# EasyEDA Pro project llc.eprj

# Schematic Schematic1

## Sheets
1 P1: Create Date: 2024-04-23; Page Name: P1; Project Name: llc; Schematic Name: Schematic1; Update Date: 2024-04-23; Company: EasyEDA.com; Drawn: EasyEDA; Page Size: A4; Part Number: JLCPCB-002; Reviewed: EasyEDA; Version: V0.1
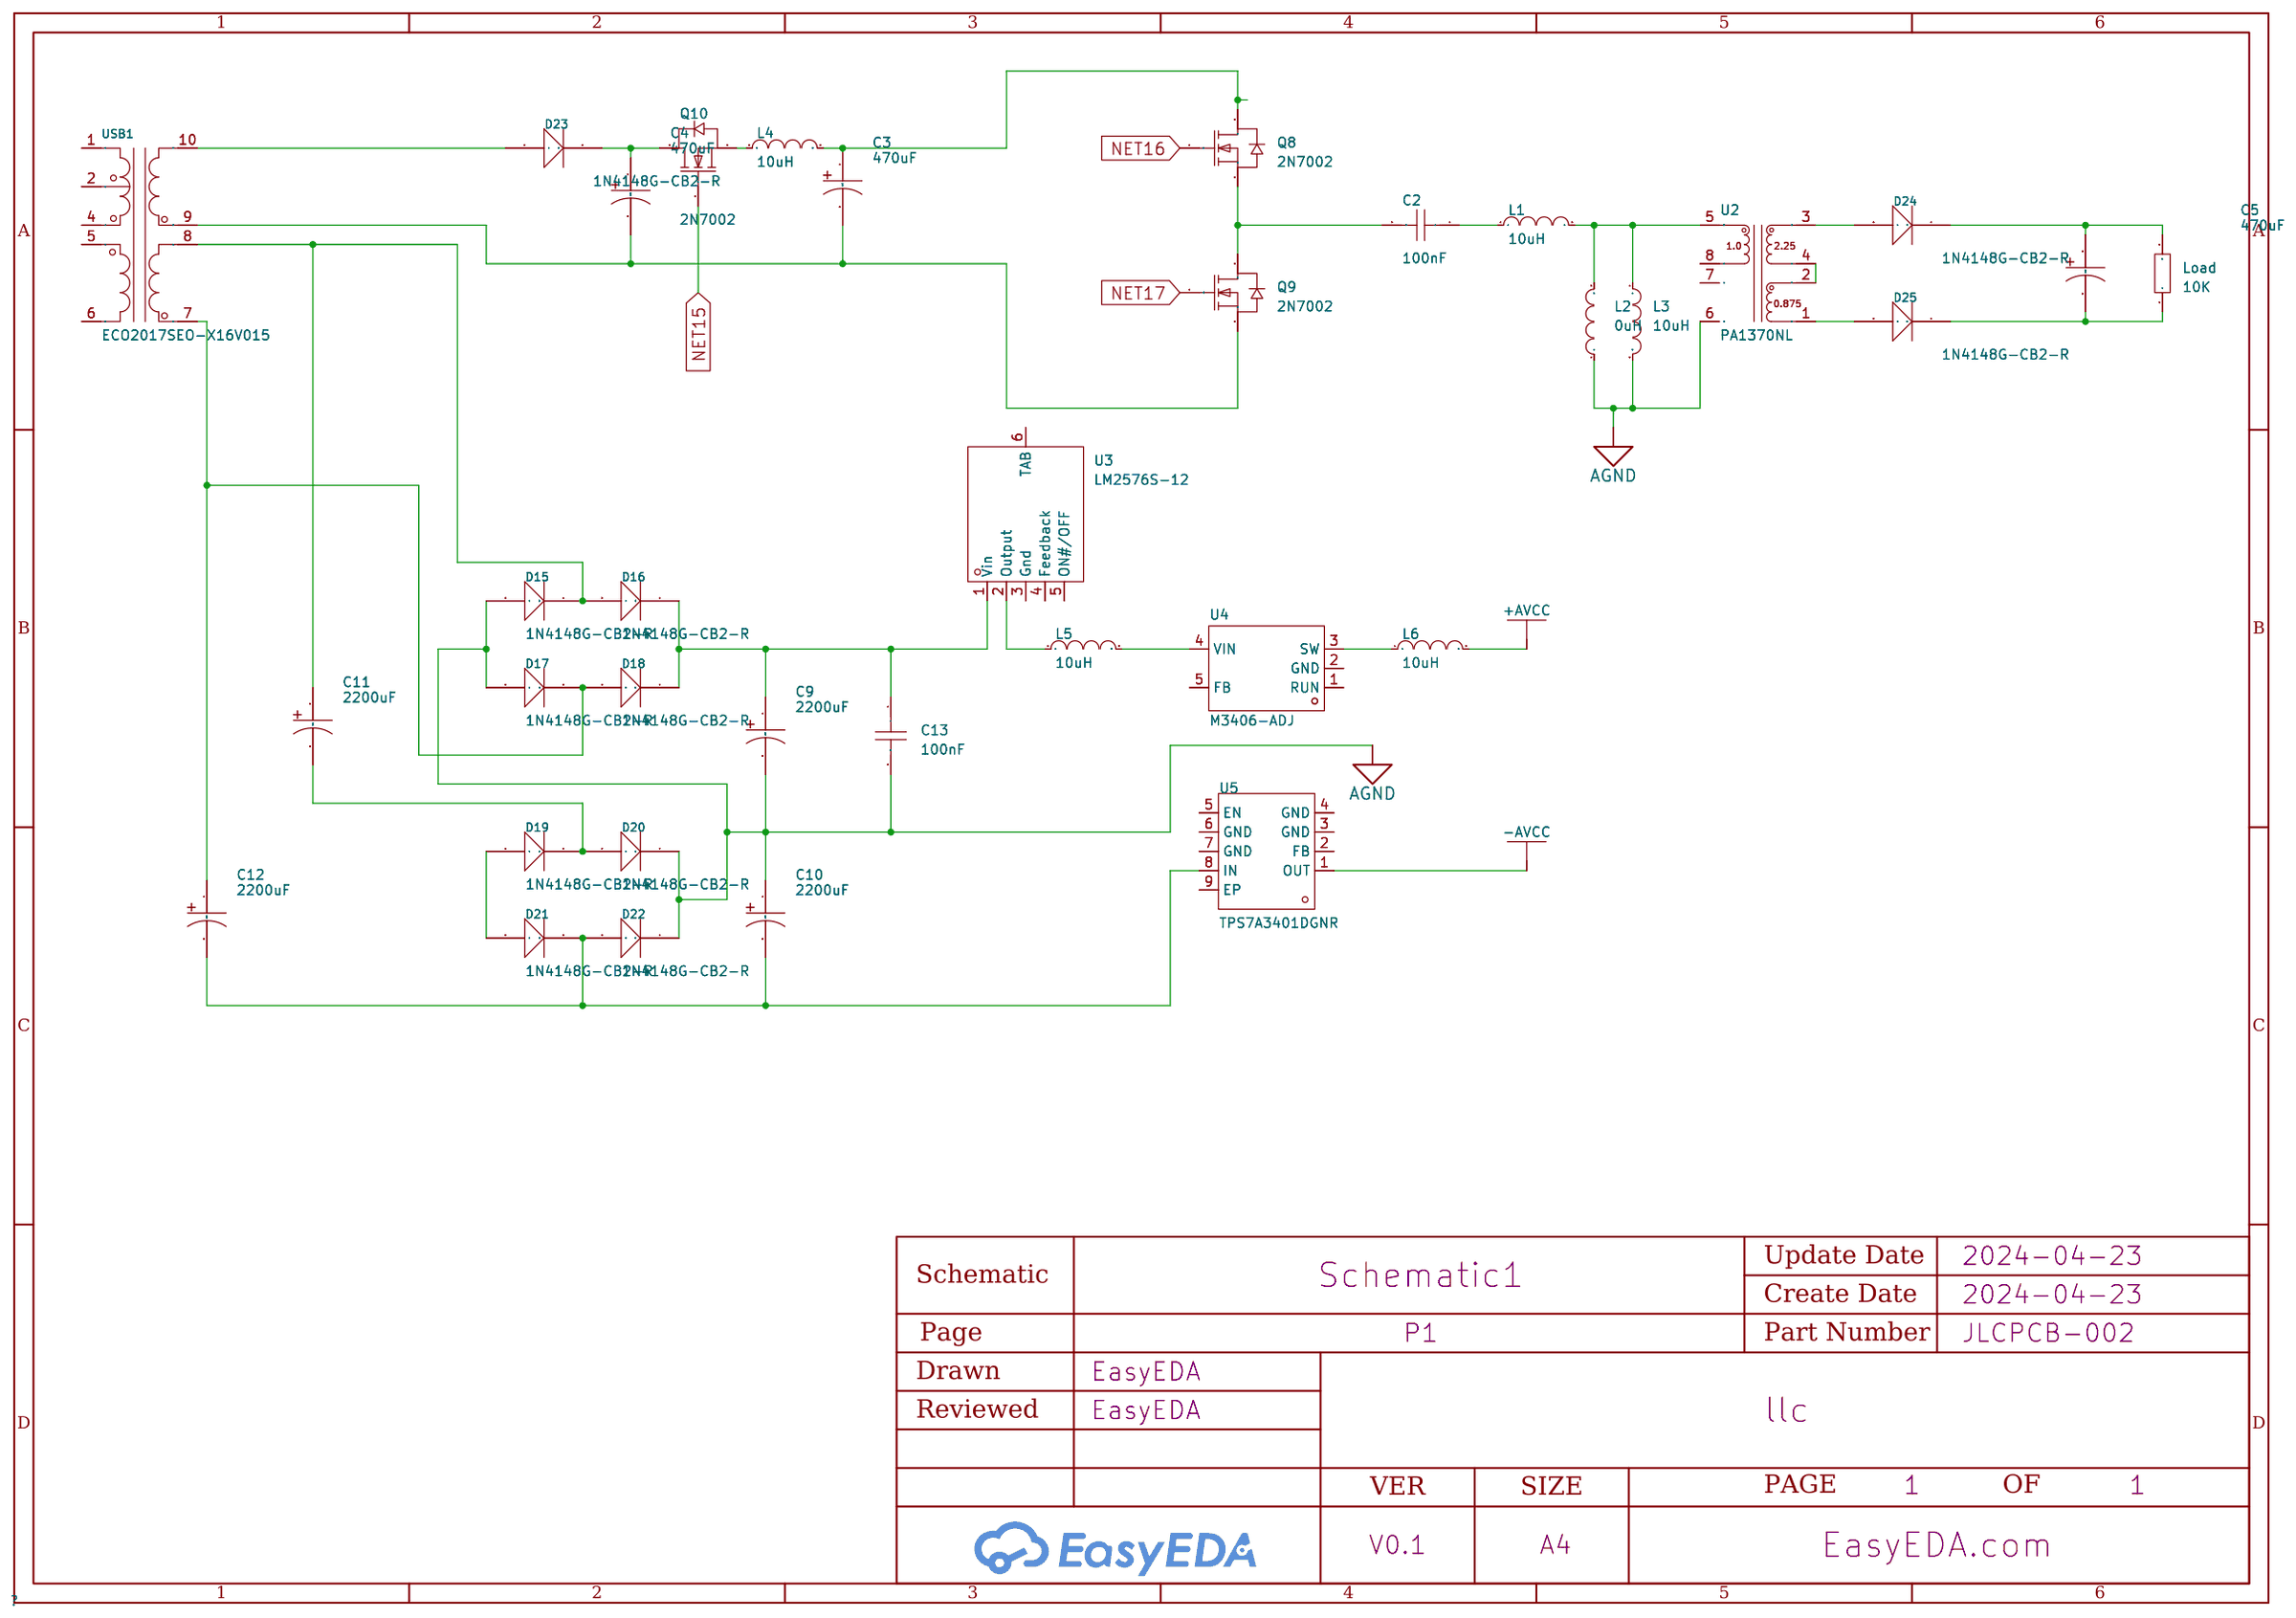
[diagram p0: P1]
2 P3: Page Name: P3; Update Date: 2024-04-24
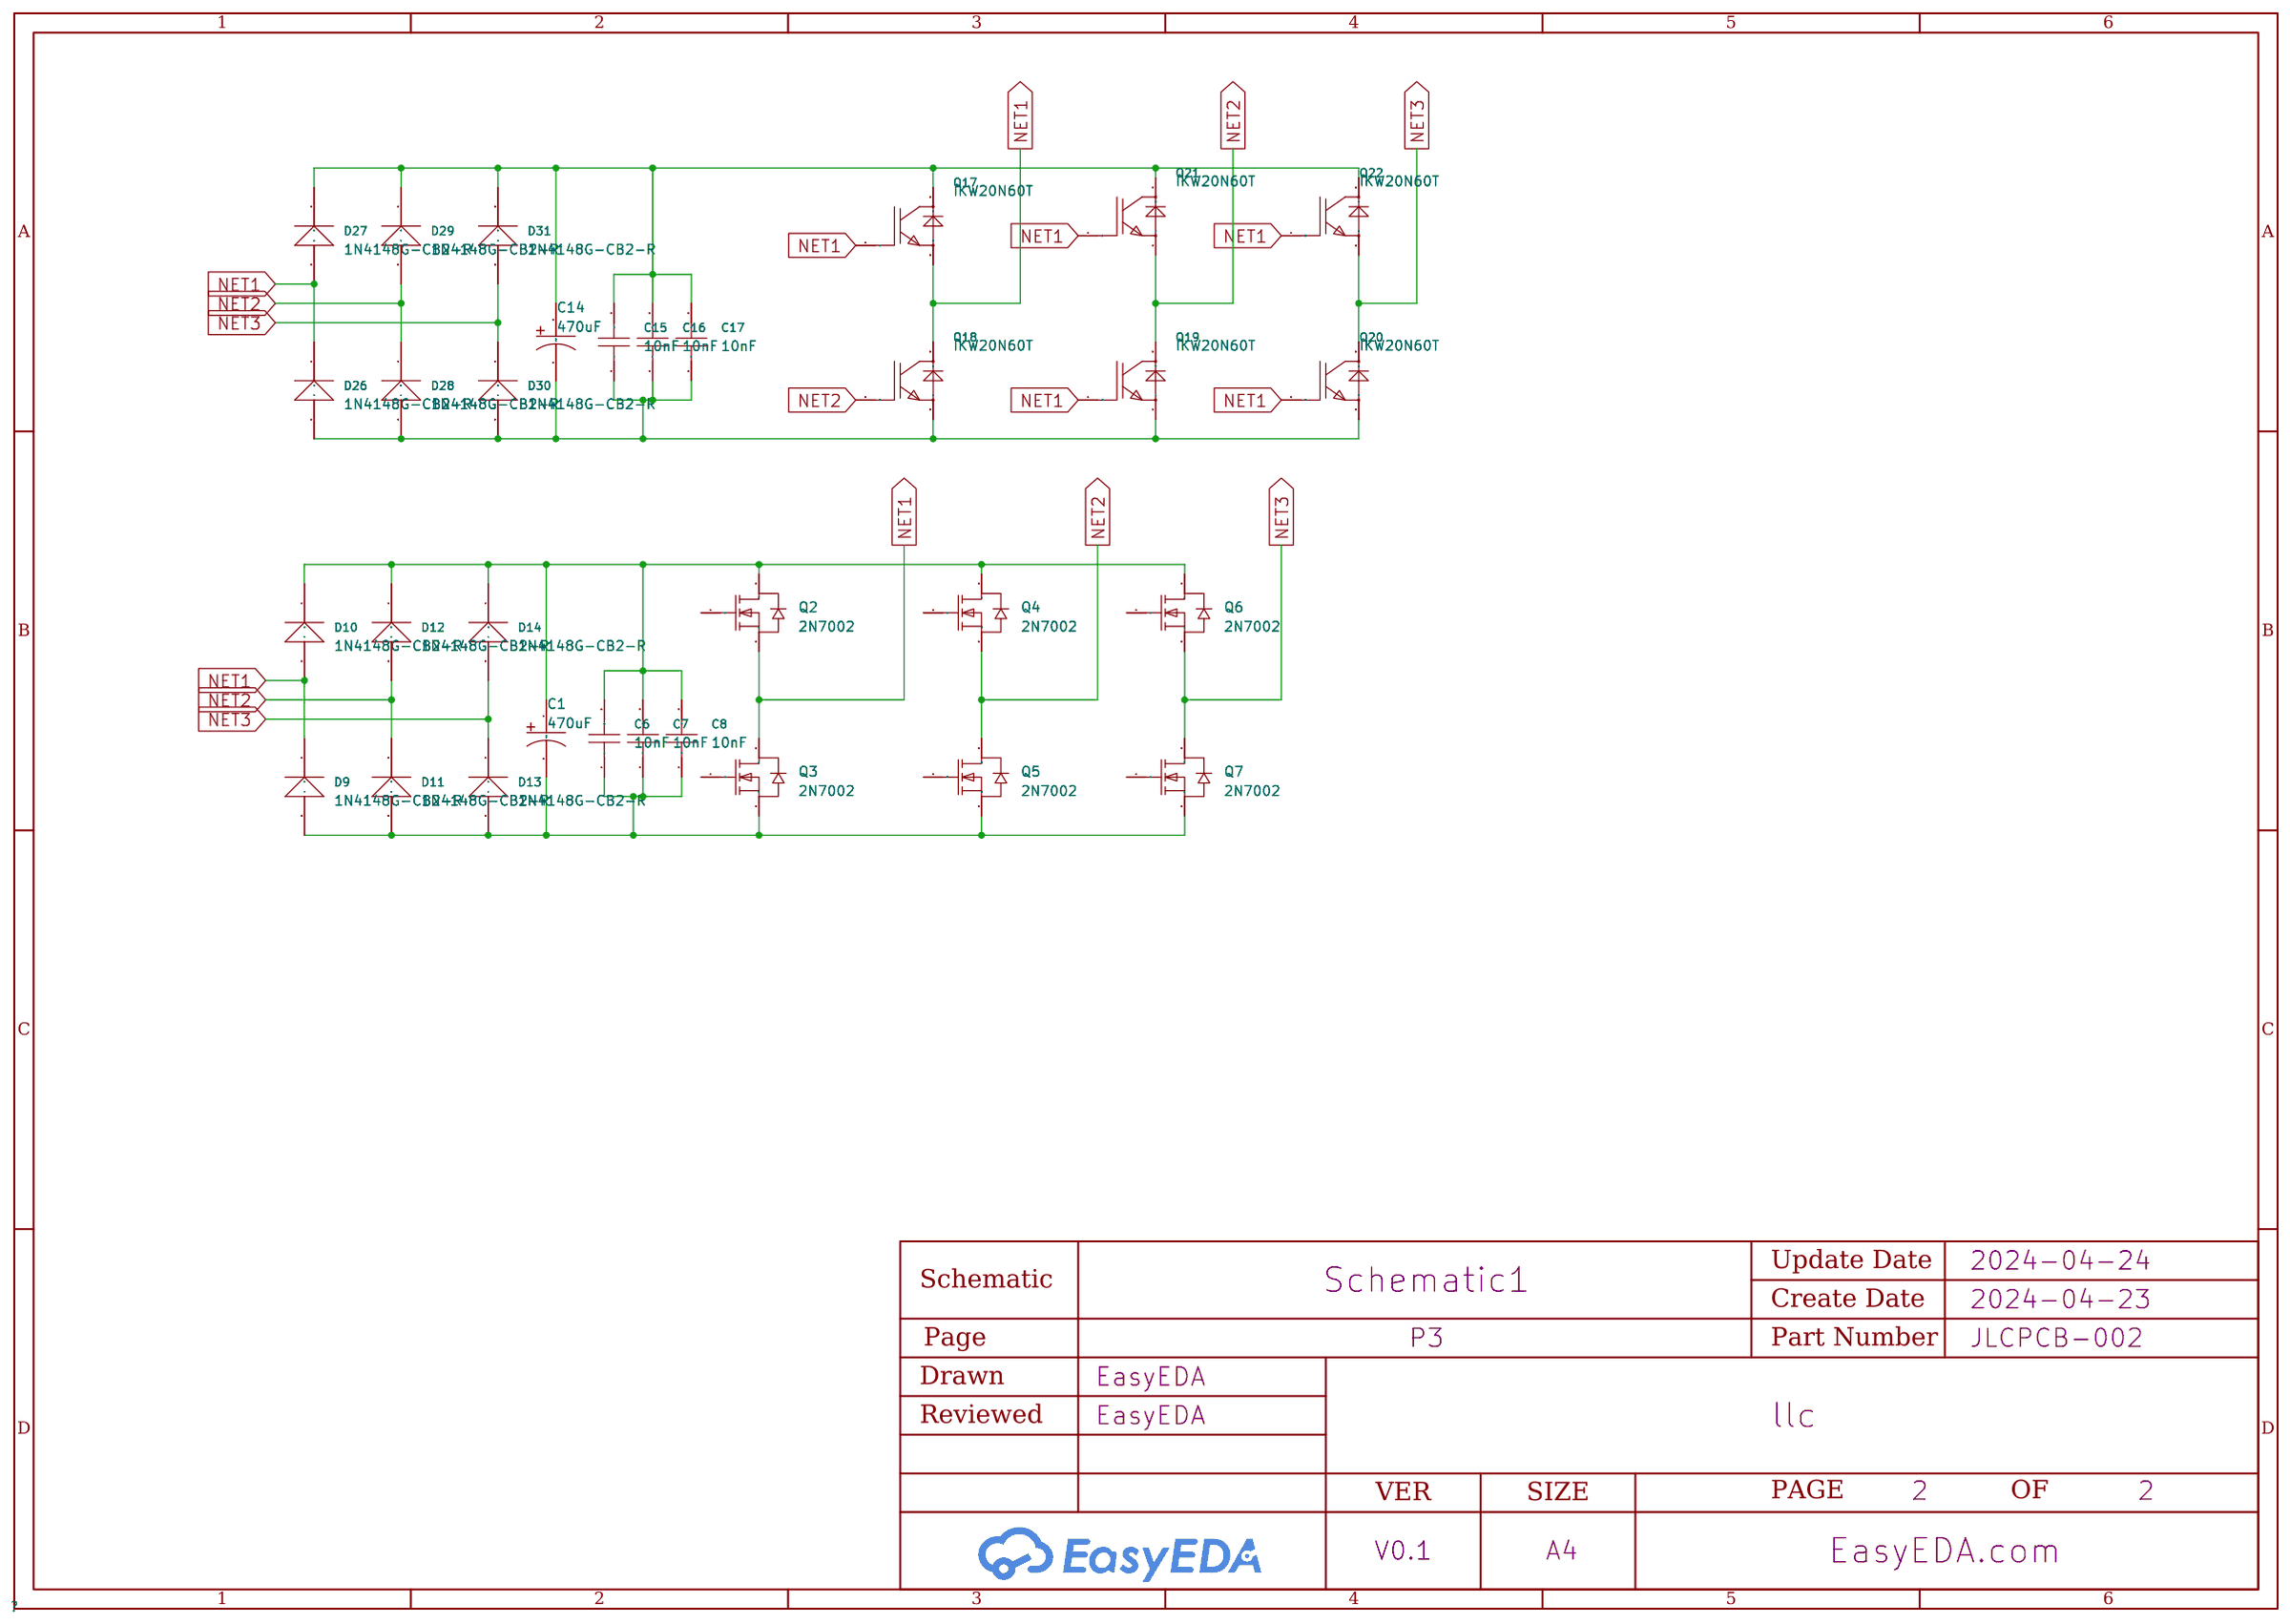
[diagram p1: P3]

## Parts
sheet P1
C2  100nF  [C0603]
C3  470uF  [CAP-TH_BD35.0-P10.00-D2.3-FD]
C4  470uF  [CAP-TH_BD35.0-P10.00-D2.3-FD]
C5  470uF  [CAP-TH_BD35.0-P10.00-D2.3-FD]
C9  2200uF  [CAP-TH_BD12.5-P5.00-D0.6-FD]
C10  2200uF  [CAP-TH_BD12.5-P5.00-D0.6-FD]
C11  2200uF  [CAP-TH_BD12.5-P5.00-D0.6-FD]
C12  2200uF  [CAP-TH_BD12.5-P5.00-D0.6-FD]
C13  100nF  [C0603]
D15  1N4148G-CB2-R  [SOD-323_L1.8-W1.3-LS2.5-RD]
D16  1N4148G-CB2-R  [SOD-323_L1.8-W1.3-LS2.5-RD]
D17  1N4148G-CB2-R  [SOD-323_L1.8-W1.3-LS2.5-RD]
D18  1N4148G-CB2-R  [SOD-323_L1.8-W1.3-LS2.5-RD]
D19  1N4148G-CB2-R  [SOD-323_L1.8-W1.3-LS2.5-RD]
D20  1N4148G-CB2-R  [SOD-323_L1.8-W1.3-LS2.5-RD]
D21  1N4148G-CB2-R  [SOD-323_L1.8-W1.3-LS2.5-RD]
D22  1N4148G-CB2-R  [SOD-323_L1.8-W1.3-LS2.5-RD]
D23  1N4148G-CB2-R  [SOD-323_L1.8-W1.3-LS2.5-RD]
D24  1N4148G-CB2-R  [SOD-323_L1.8-W1.3-LS2.5-RD]
D25  1N4148G-CB2-R  [SOD-323_L1.8-W1.3-LS2.5-RD]
L1  10uH  [L0603]
L2  0uH  [L0603]
L3  10uH  [L0603]
L4  10uH  [L0603]
L5  10uH  [L0603]
L6  10uH  [L0603]
Load  10K  [R0603]
Q8  2N7002  [SOT-23-3_L2.9-W1.3-P1.90-LS2.4-BR]
Q9  2N7002  [SOT-23-3_L2.9-W1.3-P1.90-LS2.4-BR]
Q10  2N7002  [SOT-23-3_L2.9-W1.3-P1.90-LS2.4-BR]
U2  PA1370NL  [XFMR-SMD_PA1370NL]
U3  LM2576S-12  [TO-263-5_L10.2-W8.9-P1.70-BR]
U4  M3406-ADJ  [SOT-23-5_L3.0-W1.7-P0.95-LS2.8-BR]
U5  TPS7A3401DGNR  [MSOP-8_L3.0-W3.0-P0.65-LS4.9-BL-EP]
USB1  ECO2017SEO-X16V015  [XFMR-TH_ECO2017SEO-X16V015]
sheet P3
C1  470uF  [CAP-TH_BD35.0-P10.00-D2.3-FD]
C6  10nF  [CAP-TH_L14.0-W5.0-P7.50-D0.6-LS3.0]
C7  10nF  [CAP-TH_L14.0-W5.0-P7.50-D0.6-LS3.0]
C8  10nF  [CAP-TH_L14.0-W5.0-P7.50-D0.6-LS3.0]
C14  470uF  [CAP-TH_BD35.0-P10.00-D2.3-FD]
C15  10nF  [CAP-TH_L14.0-W5.0-P7.50-D0.6-LS3.0]
C16  10nF  [CAP-TH_L14.0-W5.0-P7.50-D0.6-LS3.0]
C17  10nF  [CAP-TH_L14.0-W5.0-P7.50-D0.6-LS3.0]
D9  1N4148G-CB2-R  [SOD-323_L1.8-W1.3-LS2.5-RD]
D10  1N4148G-CB2-R  [SOD-323_L1.8-W1.3-LS2.5-RD]
D11  1N4148G-CB2-R  [SOD-323_L1.8-W1.3-LS2.5-RD]
D12  1N4148G-CB2-R  [SOD-323_L1.8-W1.3-LS2.5-RD]
D13  1N4148G-CB2-R  [SOD-323_L1.8-W1.3-LS2.5-RD]
D14  1N4148G-CB2-R  [SOD-323_L1.8-W1.3-LS2.5-RD]
D26  1N4148G-CB2-R  [SOD-323_L1.8-W1.3-LS2.5-RD]
D27  1N4148G-CB2-R  [SOD-323_L1.8-W1.3-LS2.5-RD]
D28  1N4148G-CB2-R  [SOD-323_L1.8-W1.3-LS2.5-RD]
D29  1N4148G-CB2-R  [SOD-323_L1.8-W1.3-LS2.5-RD]
D30  1N4148G-CB2-R  [SOD-323_L1.8-W1.3-LS2.5-RD]
D31  1N4148G-CB2-R  [SOD-323_L1.8-W1.3-LS2.5-RD]
Q2  2N7002  [SOT-23-3_L2.9-W1.3-P1.90-LS2.4-BR]
Q3  2N7002  [SOT-23-3_L2.9-W1.3-P1.90-LS2.4-BR]
Q4  2N7002  [SOT-23-3_L2.9-W1.3-P1.90-LS2.4-BR]
Q5  2N7002  [SOT-23-3_L2.9-W1.3-P1.90-LS2.4-BR]
Q6  2N7002  [SOT-23-3_L2.9-W1.3-P1.90-LS2.4-BR]
Q7  2N7002  [SOT-23-3_L2.9-W1.3-P1.90-LS2.4-BR]
Q17  IKW20N60T  [TO-247AC-3_L15.8-W5.0-P5.46-L]
Q18  IKW20N60T  [TO-247AC-3_L15.8-W5.0-P5.46-L]
Q19  IKW20N60T  [TO-247AC-3_L15.8-W5.0-P5.46-L]
Q20  IKW20N60T  [TO-247AC-3_L15.8-W5.0-P5.46-L]
Q21  IKW20N60T  [TO-247AC-3_L15.8-W5.0-P5.46-L]
Q22  IKW20N60T  [TO-247AC-3_L15.8-W5.0-P5.46-L]

## Library data of the parts
C2 C13 = CAP_0603: Supplier Footprint: 0603
C1 C3-C5 C14 = B43545S7477M001: Capacitance: Tolerance:±20% Tolerance:±20% Rated Voltage: Ripple Current:2.5A@100Hz Equivalent Series Resistance(ESR):70mΩ@300Hz φD: L: Nominal of Bolt: Lead Spacing: Lifetime @ Temp:5000hrs@105℃ Operating Temperature:-25℃~+105℃ Operating Temperature:-25℃; LCSC Part Name: 470uF ±20% 550V; Supplier Part: C165783; Manufacturer: TDK; Supplier Footprint: 螺栓,D35xL70mm; JLCPCB Part Class: Extended Part; Datasheet: https://atta.szlcsc.com/upload/public/pdf/source/20180126/C165783_15169517207301308494.pdf; Supplier: LCSC; Tolerance: ±20%; Ripple Current: 2.5A@100Hz; Equivalent Series Resistance(ESR): 70mΩ@300Hz; Lifetime @ Temp: 5000hrs@105℃; Operating Temperature: -25℃~+105℃
C9-C12 = RGA222M1EBK-1325: Capacitance: Tolerance:±20% Tolerance:±20% Rated Voltage: Lead Spacing: φD: L: Lifetime @ Temp:2000hrs@105℃; LCSC Part Name: 2200uF ±20% 25V; Supplier Part: C134573; Manufacturer: lelon(立隆); Supplier Footprint: 插件,D12.5xL25mm; JLCPCB Part Class: Extended Part; Datasheet: https://atta.szlcsc.com/upload/public/pdf/source/20190827/C416346_445A0B7A49AD27A9C1655D2C5BBCA321.pdf; Supplier: LCSC; Tolerance: ±20%; Lifetime @ Temp: 2000hrs@105℃
D9-D31 = 1N4148G-CB2-R: Diode Configuration: Forward Voltage (Vf@If):1V@10mA Reverse Voltage (Vr): Average Rectified Current (Io): Power Dissipation: Reverse Leakage Current:5uA@75V Reverse Recovery Time (trr): Operating Temperature:- Operating Temperature:-; LCSC Part Name: 电压:100V 电流:200mA; Supplier Part: C94001; Manufacturer: UTC(友顺); Supplier Footprint: SOD-323; JLCPCB Part Class: Extended Part; Datasheet: https://atta.szlcsc.com/upload/public/pdf/source/20190926/C431680_EA5AB486B087562F5C5C8C2F497EE459.pdf; Supplier: LCSC; Forward Voltage (Vf@If): 1V@10mA; Reverse Leakage Current: 5uA@75V
L1-L6 = L_0603
Load = Res_0603: Supplier Footprint: 0603
Q2-Q10 = 2N7002_C8545: Type: Drain Source Voltage (Vdss): Continuous Drain Current (Id): Power Dissipation (Pd): Drain Source On Resistance (RDS(on)@Vgs,Id):7.5Ω@10V,500mA Gate Threshold Voltage (Vgs(th)@Id):2.5V@250uA; LCSC Part Name: N沟道 耐压:60V 电流:115mA; Supplier Part: C8545; Manufacturer: CJ(江苏长电/长晶); Supplier Footprint: SOT-23; JLCPCB Part Class: Basic Part; Datasheet: https://atta.szlcsc.com/upload/public/pdf/source/20171228/C164913_15144413269051213916.pdf; Supplier: LCSC; Drain Source On Resistance (RDS(on)@Vgs,Id): 7.5Ω@10V,500mA; Gate Threshold Voltage (Vgs(th)@Id): 2.5V@250uA
U2 = PA1370NL: Inductor:20.4uH operating temperature:-40℃~+130℃ operating temperature:-40℃~+130℃; Supplier Part: C5706784; Manufacturer: PULSE(普思); Datasheet: https://atta.szlcsc.com/upload/public/pdf/source/20230606/080D1B2A6020DA26C04584848CB3F13E.pdf; Supplier: LCSC; Inductor: 20.4uH; operating temperature: -40℃~+130℃
U3 = LM2576S-12_C347414: Function:Step-down type Output Type:Fixed Input Voltage:40V Input Voltage:40V Output Voltage:12V Output Voltage:12V Output Current (Max):3A Switching Frequency:52kHz Operating Temperature:-40℃~+125℃@(TA) Operating Temperature:-40℃~+125℃@(TA) Synchronous R; Supplier Part: C347414; Manufacturer: UMW(友台半导体); Supplier Footprint: TO-263-5; JLCPCB Part Class: Extended Part; Datasheet: https://atta.szlcsc.com/upload/public/pdf/source/20231109/97ACD99236AD6FA78302E85E1B8CCF74.pdf; Supplier: LCSC; Function: Step-down type; Output Type: Fixed; Input Voltage: 40V; Output Voltage: 12V; Output Current (Max): 3A; Switching Frequency: 52kHz; Operating Temperature: -40℃~+125℃@(TA); Synchronous Rectification: Yes; Number of Outputs: 1; Topology: Step-down; Quiescent Current (Iq): 5mA; Switch tube (built-in/external): 内置
U4 = M3406-ADJ_C83224: Function:Step-down type Input Voltage:- Input Voltage:- Output Current (Max):- Switching Frequency:- Synchronous Rectification:- Number of Outputs:- Topology:- Switch tube (built-in/external):内置; Supplier Part: C83224; Manufacturer: 西安航天民芯; Supplier Footprint: SOT-23-5; JLCPCB Part Class: Extended Part; Datasheet: https://atta.szlcsc.com/upload/public/pdf/source/20180301/C181743_15198944852831384030.pdf; Supplier: LCSC; Function: Step-down type; Switch tube (built-in/external): 内置
U5 = TPS7A3401DGNR: Output Type:可调 Maximum Input Voltage:20V Output Voltage:1.18V~18V Output Voltage:1.18V~18V MAX Output Current:200mA Power Supply Rejection Ratio (PSRR):50dB@(1kHz) Dropout Voltage:0.8V@(200mA) standby current:100uA Operating Temperature:-40℃~+125℃ Operati; Supplier Part: C2879160; Manufacturer: TI(德州仪器); Supplier Footprint: MSOP-8-EP; JLCPCB Part Class: Extended Part; Datasheet: https://www.ti.com/cn/lit/gpn/tps7a3401; Supplier: LCSC; Output Type: 可调; Maximum Input Voltage: 20V; Output Voltage: 1.18V~18V; MAX Output Current: 200mA; Power Supply Rejection Ratio (PSRR): 50dB@(1kHz); Dropout Voltage: 0.8V@(200mA); standby current: 100uA; Operating Temperature: -40℃~+125℃; Output Polarity: Negative electrode; Number of Outputs: 1
USB1 = ECO2017SEO-X16V015: Primary Side Voltage:- Secondary Side Voltage:- Output Current:- Power:- Primary Winding:三路 Secondary Winding:两路 Isolation Voltage:-; Supplier Part: C2762803; Manufacturer: TDK; Supplier Footprint: 插件; JLCPCB Part Class: Extended Part; Datasheet: https://atta.szlcsc.com/upload/public/pdf/source/20210330/C2762803_0539F2D7383AC707985FED84B39ED265.pdf; Supplier: LCSC; Primary Winding: 三路; Secondary Winding: 两路
C6-C8 C15-C17 = Y5V103M2KV16CC0204: Capacitance: Tolerance:±20% Tolerance:±20% Voltage Rated: Lead Spacing: Temperature Coefficient: φD:- Body Thickness:-; LCSC Part Name: 10nF ±20% 2kV; Supplier Part: C2887267; Manufacturer: KNSCHA(科尼盛); Supplier Footprint: 插件,P=7.5mm; JLCPCB Part Class: Extended Part; Datasheet: https://atta.szlcsc.com/upload/public/pdf/source/20210824/1D87C4D92B7F13F8C855ED38170DECAF.pdf; Supplier: LCSC; Tolerance: ±20%
Q17-Q22 = IKW20N60T: Supplier Part: C10456; Manufacturer: Infineon(英飞凌); Supplier Footprint: TO-247AC-3; JLCPCB Part Class: Extended Part; Datasheet: https://atta.szlcsc.com/upload/public/pdf/source/20121215/1457706569365.pdf; Supplier: LCSC

## Nets
+AVCC: L6.2
-AVCC: U5.1(OUT)
AGND: C9.2 C10.1 C13.2 D15.2(A) D17.2(A) D20.1(C) D22.1(C) L2.1 L3.2 U2.6
NET1: D9.1(C) D10.2(A) D26.1(C) D27.2(A) Q2.2(S) Q3.3(D) Q17.1(G) Q17.3(E) Q18.2(C) Q19.1(G) Q20.1(G) Q21.1(G) Q22.1(G)
NET2: D11.1(C) D12.2(A) D28.1(C) D29.2(A) Q4.2(S) Q5.3(D) Q18.1(G) Q19.2(C) Q21.3(E)
NET3: D13.1(C) D14.2(A) D30.1(C) D31.2(A) Q6.2(S) Q7.3(D) Q20.2(C) Q22.3(E)
NET15: Q10.1(G)
NET16: Q8.1(G)
NET17: Q9.1(G)
Net-(C1-1): C1.1 C6.2 C7.2 C8.2 D10.1(C) D12.1(C) D14.1(C) Q2.3(D) Q4.3(D) Q6.3(D)
Net-(C1-2): C1.2 C6.1 C7.1 C8.1 D9.2(A) D11.2(A) D13.2(A) Q3.2(S) Q5.2(S) Q7.2(S)
Net-(C2-1): C2.1 L1.1
Net-(C2-2): C2.2 Q8.2(S) Q9.3(D)
Net-(C3-1): C3.1 L4.2 Q8.3(D)
Net-(C3-2): C3.2 C4.2 Q9.2(S) USB1.9
Net-(C4-1): C4.1 D23.1(C) Q10.3(D)
Net-(C5-1): C5.1 D24.1(C) Load.2
Net-(C5-2): C5.2 D25.1(C) Load.1
Net-(C9-1): C9.1 C13.1 D16.1(C) D18.1(C) U3.1(Vin)
Net-(C10-2): C10.2 C12.2 D21.1(C) D22.2(A) U5.8(IN)
Net-(C11-1): C11.1 D15.1(C) D16.2(A) USB1.8
Net-(C11-2): C11.2 D19.1(C) D20.2(A)
Net-(C12-1): C12.1 D17.1(C) D18.2(A) USB1.7
Net-(C14-1): C14.1 C15.2 C16.2 C17.2 D27.1(C) D29.1(C) D31.1(C) Q17.2(C) Q21.2(C) Q22.2(C)
Net-(C14-2): C14.2 C15.1 C16.1 C17.1 D26.2(A) D28.2(A) D30.2(A) Q18.3(E) Q19.3(E) Q20.3(E)
Net-(D19-2): D19.2(A) D21.2(A)
Net-(D23-2): D23.2(A) USB1.10
Net-(D24-2): D24.2(A) U2.3
Net-(D25-2): D25.2(A) U2.1
Net-(L1-2): L1.2 L2.2 L3.1 U2.5
Net-(L4-1): L4.1 Q10.2(S)
Net-(L5-1): L5.1 U3.2(Output)
Net-(L5-2): L5.2 U4.4(VIN)
Net-(L6-1): L6.1 U4.3(SW)
Net-(U2-2): U2.2 U2.4

Not connected (* = marked no-connect by the designer): Q2 1(G); Q3 1(G); Q4 1(G); Q5 1(G); Q6 1(G); Q7 1(G); U2 7 8; U3 3(Gnd) 4(Feedback) 5(ON#/OFF) 6(TAB); U4 1(RUN) 2(GND) 5(FB); U5 2(FB) 3(GND) 4(GND) 5(EN) 6(GND) 7(GND) 9(EP); USB1 1 2 4 5 6
